# EAGLE schematic Main (EAGLE 8.7.0)
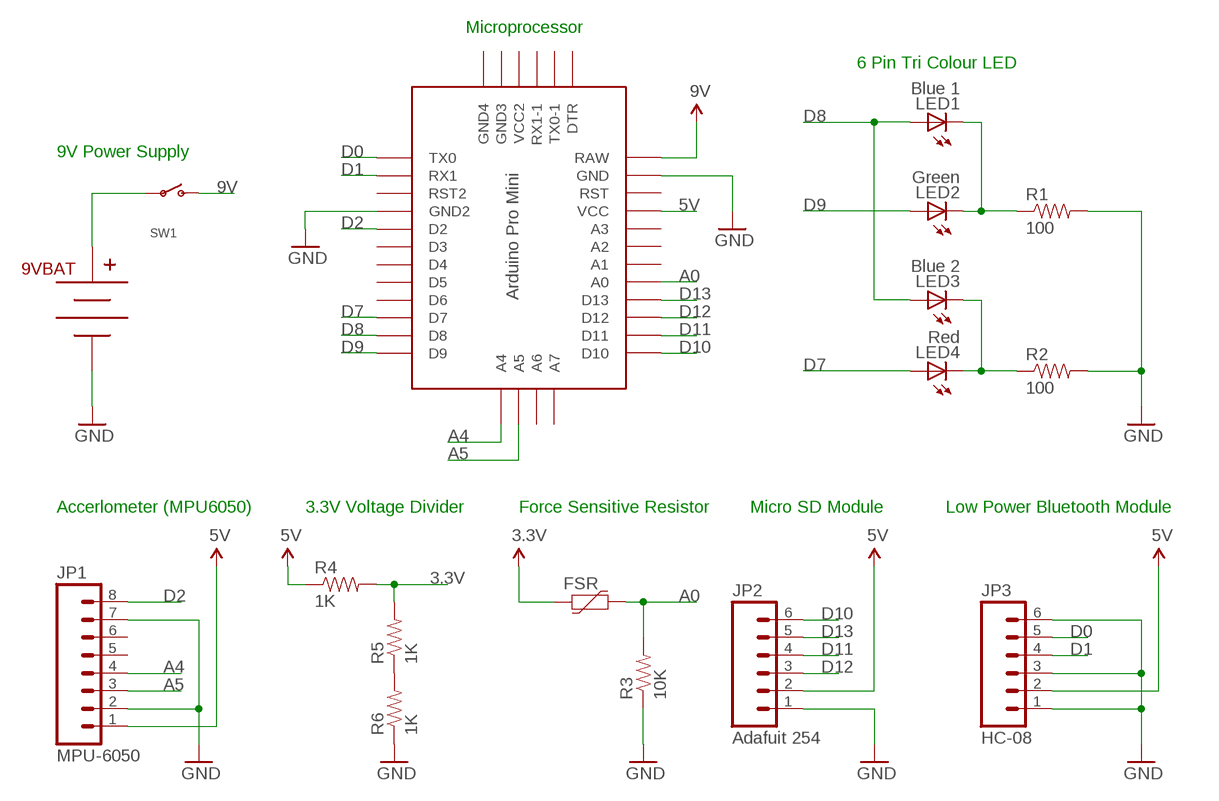
[diagram p0: schematic, sheet 1]

## Parts
9VBAT  BC9VPC  [BC9VPC]
FSR  VARISTOR-0603  [0603-RES]
JP1  MPU-6050  M081X08  [1X08]
JP2  Adafuit 254  M06SIP  [1X06]
JP3  HC-08  M06SIP  [1X06]
LED1  Blue 1  LED5MM  [LED5MM]
LED2  Green  LED5MM  [LED5MM]
LED3  Blue 2  LED5MM  [LED5MM]
LED4  Red  LED5MM  [LED5MM]
MICROPROCESSOR  PRO-MINI  [PRO-MINI]
R1  100  RESISTORAXIAL-0.3  [AXIAL-0.3]
R2  100  RESISTORAXIAL-0.3  [AXIAL-0.3]
R3  10K  RESISTORAXIAL-0.3  [AXIAL-0.3]
R4  1K  RESISTORAXIAL-0.3  [AXIAL-0.3]
R5  1K  RESISTORAXIAL-0.3  [AXIAL-0.3]
R6  1K  RESISTORAXIAL-0.3  [AXIAL-0.3]
SW1  SWITCH_SPST  [SPST_SMT_19192]

## Nets
3.3V: FSR.1 R4.P$2 R5.P$2
5V: JP1.1 JP2.2 JP3.2 MICROPROCESSOR.VCC R4.P$1
9V: SW1.C(S)
A0: FSR.2 MICROPROCESSOR.A0 R3.P$2
A4: JP1.4 MICROPROCESSOR.A4
A5: JP1.3 MICROPROCESSOR.A5
BG_LED: LED1.K(C) LED2.K(C) R1.P$1
D0: JP3.5 MICROPROCESSOR.TX0
D1: JP3.4 MICROPROCESSOR.RX1
D2: JP1.8 MICROPROCESSOR.D2
D7: LED4.A MICROPROCESSOR.D7
D8: LED1.A LED3.A MICROPROCESSOR.D8
D9: LED2.A MICROPROCESSOR.D9
D10: JP2.6 MICROPROCESSOR.D10
D11: JP2.4 MICROPROCESSOR.D11
D12: JP2.3 MICROPROCESSOR.D12
D13: JP2.5 MICROPROCESSOR.D13
GND: 9VBAT.V- JP1.2 JP1.7 JP2.1 JP3.1 JP3.3 JP3.6 MICROPROCESSOR.GND MICROPROCESSOR.GND1(GND2) R1.P$2 R2.P$2 R3.P$1 R6.P$1
N$1: R5.P$1 R6.P$2
POWERSWITCH: 9VBAT.V+ SW1.B(P)
RB_LED: LED3.K(C) LED4.K(C) R2.P$1
VCC: MICROPROCESSOR.RAW ; supply symbol labelled 9V
Unconnected: JP1.5 JP1.6 MICROPROCESSOR.A1 MICROPROCESSOR.A2 MICROPROCESSOR.A3 MICROPROCESSOR.A6 MICROPROCESSOR.A7 MICROPROCESSOR.D3 MICROPROCESSOR.D4 MICROPROCESSOR.D5 MICROPROCESSOR.D6 MICROPROCESSOR.DTR MICROPROCESSOR.GND2(GND4) MICROPROCESSOR.GND3 MICROPROCESSOR.RST MICROPROCESSOR.RST1(RST2) MICROPROCESSOR.RX1-1 MICROPROCESSOR.TX0-1 MICROPROCESSOR.VCC1(VCC2)

## Notes on the sheet
- Microprocessor
- 6 Pin Tri Colour LED
- 9V Power Supply
- Accerlometer (MPU6050) | 3.3V Voltage Divider | Force Sensitive Resistor | Micro SD Module | Low Power Bluetooth Module

## Library data of the parts
9VBAT = SparkFun-Connectors:BC9VPC: 9V board-mount battery cradle
FSR = SparkFun-DiscreteSemi:VARISTOR: Varistor Varistor (Variable resistor) is a nonlinear resistive element of the voltage dependence that resistance changes with applied voltage. Varistor is equivalent with Zener diode of two series connection.
JP1 = SparkFun-Connectors:M08: Header 8 Standard 8-pin 0.1" header. Use with straight break away headers (SKU : PRT-00116), right angle break away headers (PRT-00553), swiss pins (PRT-00743), machine pins (PRT-00117), and female headers (PRT-00115).
JP2 JP3 = SparkFun-Connectors:M06: Header 6 Standard 6-pin 0.1" header. Use with straight break away headers (SKU : PRT-00116), right angle break away headers (PRT-00553), swiss pins (PRT-00743), machine pins (PRT-00117), and female headers (PRT-00115). Molex polarized connector foot print use with SKU : PRT-08094 with associated crimp pins and housings. NOTES ON THE VARIANTS LOCK and LOCK_LONGPADS... This footprint was designed to help hold the alignment of a through-hole component (i.e. 6-pin header) while soldering it into place. You may notice that each hole has been shifted either up or down by 0.005 of an inch from it's more standard position (which is a perfectly straight line). This slight alteration caused the pins (the squares in the middle) to touch the edges of the holes. Because they are alternating, it causes a "brace" to hold the component in place. 0.005 has proven to be the perfect amount of "off-center" position when using our standard breakaway headers. Although looks a little odd when you look at the bare footprint, once you have a header in there, the alteration is very hard to notice. Also, if you push a header all the way into place, it is covered up entirely on the bottom side. This idea of altering the position of holes to aid alignment will be further integrated into the Sparkfun Library for other footprints. It can help hold any component with 3 or more connection pins.
LED1-LED4 = led:LED: LED OSRAM: - CHIPLED LG R971, LG N971, LY N971, LG Q971, LY Q971, LO R971, LY R971 LH N974, LH R974 LS Q976, LO Q976, LY Q976 LO Q996 - Hyper CHIPLED LW Q18S LB Q993, LB Q99A, LB R99A - SideLED LS A670, LO A670, LY A670, LG A670, LP A670 LB A673, LV A673, LT A673, LW A673 LH A674 LY A675 LS A676, LA A676, LO A676, LY A676, LW A676 LS A679, LY A679, LG A679 - Hyper Micro SIDELED® LS Y876, LA Y876, LO Y876, LY Y876 LT Y87S - SmartLED LW L88C, LW L88S LB L89C, LB L89S, LG L890 LS L89K, LO L89K, LY L89K LS L896, LA L896, LO L896, LY L896 - TOPLED LS T670, LO T670, LY T670, LG T670, LP T670 LSG T670, LSP T670, LSY T670, LOP T670, LYG T670 LG T671, LOG T671, LSG T671 LB T673, LV T673, LT T673, LW T673 LH T674 LS T676, LA T676, LO T676, LY T676, LB T676, LH T676, LSB T676, LW T676 LB T67C, LV T67C, LT T67C, LS T67K, LO T67K, LY T67K, LW E67C LS E67B, LA E67B, LO E67B, LY E67B, LB E67C, LV E67C, LT E67C LW T67C LS T679, LY T679, LG T679 LS T770, LO T770, LY T770, LG T770, LP T770 LB T773, LV T773, LT T773, LW T773 LH T774 LS E675, LA E675, LY E675, LS T675 LS T776, LA T776, LO T776, LY T776, LB T776 LHGB T686 LT T68C, LB T68C - Hyper Mini TOPLED® LB M676 - Mini TOPLED Santana® LG M470 LS M47K, LO M47K, LY M47K Source: http://www.osram.convergy.de LUXEON: - LUMILED® LXK2-PW12-R00, LXK2-PW12-S00, LXK2-PW14-U00, LXK2-PW14-V00 LXK2-PM12-R00, LXK2-PM12-S00, LXK2-PM14-U00 LXK2-PE12-Q00, LXK2-PE12-R00, LXK2-PE12-S00, LXK2-PE14-T00, LXK2-PE14-U00 LXK2-PB12-K00, LXK2-PB12-L00, LXK2-PB12-M00, LXK2-PB14-N00, LXK2-PB14-P00, LXK2-PB14-Q00 LXK2-PR12-L00, LXK2-PR12-M00, LXK2-PR14-Q00, LXK2-PR14-R00 LXK2-PD12-Q00, LXK2-PD12-R00, LXK2-PD12-S00 LXK2-PH12-R00, LXK2-PH12-S00 LXK2-PL12-P00, LXK2-PL12-Q00, LXK2-PL12-R00 Source: www.luxeon.com KINGBRIGHT: KA-3528ASYC Source: www.kingbright.com
MICROPROCESSOR = Arduino-clone:PRO-MINI: Arduion Pro Mini Clone V1.0 www.betemcu.cu
R1-R6 = SparkFun-Passives:RESISTOR: Resistor Basic schematic elements and footprints for 0603, 1206, and PTH resistors.
SW1 = microbuilder:SWITCH_SPST: Switch - SPST 4UCon 19192 (6.7x2.6mm SMT)